# Altium project stlink.PrjPcb
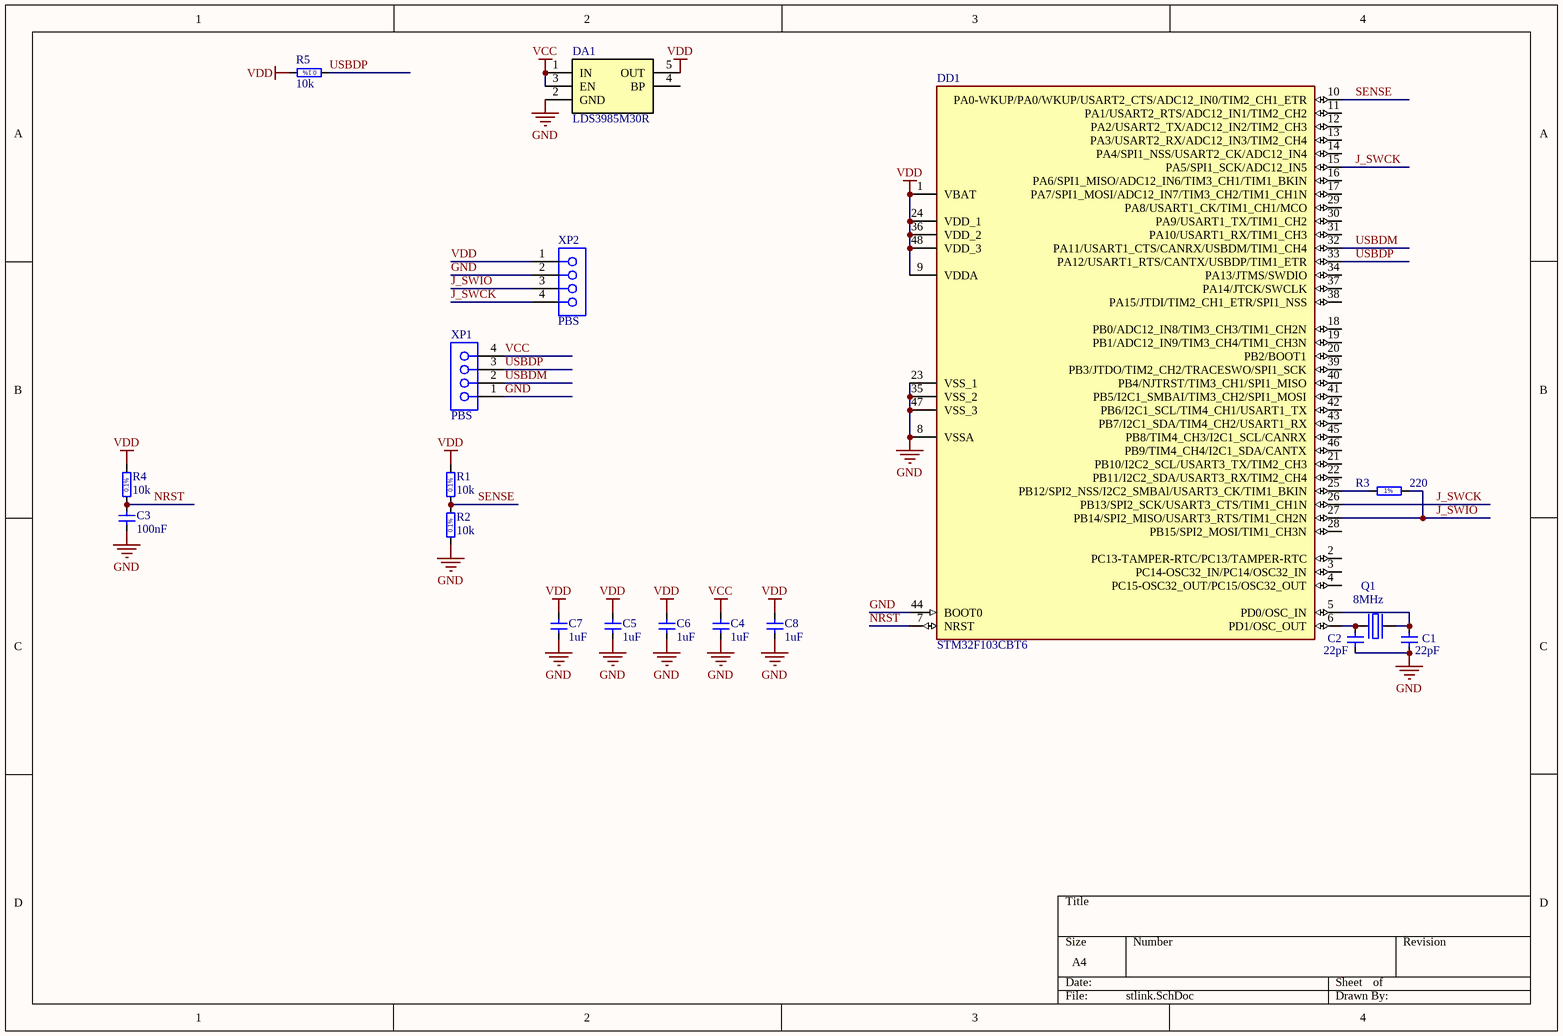
[diagram p0: stlink.SchDoc]
1 sheet, 18 parts. Net scope: global (net labels, ports and power ports of the same name join across sheets).
Board file: stlink.PcbDoc

## Sheet stlink.SchDoc
size A4

### Parts
C1  22pF  [CAP0603R]
C2  22pF  [CAP0603R]
C3  100nF  [CAP0603R]
C4  1uF  [CAP0603R]
C5  1uF  [CAP0603R]
C6  1uF  [CAP0603R]
C7  1uF  [CAP0603R]
C8  1uF  [CAP0603R]
DA1  LDS3985M30R  [SOT23-5]
DD1  STM32F103CBT6  [LQFP48]
Q1  8MHz  [XTAL_HC-49/U]
R1  10k  [RES0603R]
R2  10k  [RES0603R]
R3  220  [RES0603R]
R4  10k  [RES0603R]
R5  10k  [RES0603R]
XP1  PBS  [PBS-04]
XP2  PBS  [PBS-04]

### Nets
GND: C1.1 C2.1 C3.1 C4.1 C5.1 C6.1 C7.1 C8.1 DA1.2(GND) DD1.8(VSSA) DD1.23(VSS_1) DD1.35(VSS_2) DD1.44(BOOT0) DD1.47(VSS_3) R2.1 XP1.1 XP2.2
VCC: C4.2 DA1.1(IN) DA1.3(EN) XP1.4
VDD: C5.2 C6.2 C7.2 C8.2 DA1.5(OUT) DD1.1(VBAT) DD1.9(VDDA) DD1.24(VDD_1) DD1.36(VDD_2) DD1.48(VDD_3) R1.2 R4.2 R5.2 XP2.1
J_SWCK: DD1.15(PA5/SPI1_SCK/ADC12_IN5) DD1.26(PB13/SPI2_SCK/USART3_CTS/TIM1_CH1N) XP2.4
J_SWIO: DD1.27(PB14/SPI2_MISO/USART3_RTS/TIM1_CH2N) R3.2 XP2.3
NRST: C3.2 DD1.7(NRST) R4.1
SENSE: DD1.10(PA0-WKUP/PA0/WKUP/USART2_CTS/ADC12_IN0/TIM2_CH1_ETR) R1.1 R2.2
USBDM: DD1.32(PA11/USART1_CTS/CANRX/USBDM/TIM1_CH4) XP1.2
USBDP: DD1.33(PA12/USART1_RTS/CANTX/USBDP/TIM1_ETR) R5.1 XP1.3
NetC1_2: C1.2 DD1.5(PD0/OSC_IN) Q1.2(OSC2)
NetC2_2: C2.2 DD1.6(PD1/OSC_OUT) Q1.1(OSC1)
NetDD1_25: DD1.25(PB12/SPI2_NSS/I2C2_SMBAl/USART3_CK/TIM1_BKIN) R3.1

Not connected (* = marked no-connect by the designer): DA1 4(BP); DD1 2(PC13-TAMPER-RTC/PC13/TAMPER-RTC) 3(PC14-OSC32_IN/PC14/OSC32_IN) 4(PC15-OSC32_OUT/PC15/OSC32_OUT) 11(PA1/USART2_RTS/ADC12_IN1/TIM2_CH2) 12(PA2/USART2_TX/ADC12_IN2/TIM2_CH3) 13(PA3/USART2_RX/ADC12_IN3/TIM2_CH4) 14(PA4/SPI1_NSS/USART2_CK/ADC12_IN4) 16(PA6/SPI1_MISO/ADC12_IN6/TIM3_CH1/TIM1_BKIN) 17(PA7/SPI1_MOSI/ADC12_IN7/TIM3_CH2/TIM1_CH1N) 18(PB0/ADC12_IN8/TIM3_CH3/TIM1_CH2N) 19(PB1/ADC12_IN9/TIM3_CH4/TIM1_CH3N) 20(PB2/BOOT1) 21(PB10/I2C2_SCL/USART3_TX/TIM2_CH3) 22(PB11/I2C2_SDA/USART3_RX/TIM2_CH4) 28(PB15/SPI2_MOSI/TIM1_CH3N) 29(PA8/USART1_CK/TIM1_CH1/MCO) 30(PA9/USART1_TX/TIM1_CH2) 31(PA10/USART1_RX/TIM1_CH3) 34(PA13/JTMS/SWDIO) 37(PA14/JTCK/SWCLK) 38(PA15/JTDI/TIM2_CH1_ETR/SPI1_NSS) 39(PB3/JTDO/TIM2_CH2/TRACESWO/SPI1_SCK) 40(PB4/NJTRST/TIM3_CH1/SPI1_MISO) 41(PB5/I2C1_SMBAI/TIM3_CH2/SPI1_MOSI) 42(PB6/I2C1_SCL/TIM4_CH1/USART1_TX) 43(PB7/I2C1_SDA/TIM4_CH2/USART1_RX) 45(PB8/TIM4_CH3/I2C1_SCL/CANRX) 46(PB9/TIM4_CH4/I2C1_SDA/CANTX)

### Notes on the sheet
- (in symbol R0603_10K_0.1%_0.063W_10PPM) 0.1%
- (in symbol R0603_220R_1%_0.1W_100PPM) 1%

### Library data of the parts
C1 C2 = CC0603_22PF_50V_5%_NP0: SMD 0805 Capacitor; Part Description: SMD Multilayer Chip Ceramic Capacitor; Manufacturer: GENERIC; Manufacturer1 Part Number: 223886715229; Voltage: 50V; TC: NP0; Tolerance: ±5%; Table: Capacitors SMD; Part Number: CC0603_22PF_50V_5%_NP0; Component Kind: Standard; Component Type: Standard; Pin Count: 2; Value: 22pF; Status: Preferred; Manufacturer Part Number: CC0603_22PF_50V_5%_NP0; Case: 0603; Mounted: Yes; Socket: No; SMD: Yes; Manufacturer1 Example: PHYCOMP; Manufacturer1 ComponentHeight: 0.87mm; HelpURL: \\cern.ch\dfs\Applications\Altium\Datasheets\CC0603_NP0_PHYCOMP.pdf; Author: I. Kuznetsov; CreateDate: 03.12.2007; LatestRevisionDate: 03.12.2007
C3 = CC0603_100NF_100V_10%_X7R: SMD 0805 Capacitor; Part Description: SMD Multilayer Chip Ceramic Capacitor; Manufacturer: GENERIC; Manufacturer1 Part Number: GRM188R72A104KA35D; Voltage: 100V; TC: X7R; Tolerance: ±10%; Table: Capacitors SMD; Part Number: CC0603_100NF_100V_10%_X7R; Component Kind: Standard; Component Type: Standard; Pin Count: 2; Value: 100nF; Status: None; Manufacturer Part Number: CC0603_100NF_100V_10%_X7R; Case: 0603; Mounted: Yes; Socket: No; SMD: Yes; Manufacturer1 Example: MURATA; Manufacturer1 ComponentHeight: 0.9mm; HelpURL: \\cern.ch\dfs\Applications\Altium\Datasheets\CC0603_MURATA_GRM188R72A104KA35D.pdf; Author: I. Kuznetsov; CreateDate: 11.12.2013; LatestRevisionDate: 11.12.2013
C4-C8 = CC0603_1UF_25V_10%_X7R: SMD 0805 Capacitor; Part Description: SMD Multilayer Chip Ceramic Capacitor; Manufacturer: GENERIC; Manufacturer1 Part Number: GRM188R71E105KA12D; Voltage: 25V; TC: X7R; Tolerance: ±10%; Table: Capacitors SMD; Part Number: CC0603_1UF_25V_10%_X7R; Component Kind: Standard; Component Type: Standard; Pin Count: 2; Value: 1uF; Status: None; Manufacturer Part Number: CC0603_1UF_25V_10%_X7R; Case: 0603; Mounted: Yes; Socket: No; SMD: Yes; Manufacturer1 Example: MURATA; Manufacturer1 ComponentHeight: 0.9mm; HelpURL: \\cern.ch\dfs\Applications\Altium\Datasheets\CC0603_X7R_MURATA.pdf; Author: I. Kuznetsov; CreateDate: 18.01.2011; LatestRevisionDate: 18.01.2011
DA1 = LDS3985M30R: Manufacturer: ST; Поле1: Regulators; Part Number: LDS3985M30R; Component Kind: Standard; Component Type: Standard; Device: LDS3985M30R; Status: Active; Manufacturer Part Number: LDS3985M30R; Pin Count: 5; Case: SOT23-5; Mounted: Yes; Socket: No; SMD: Yes; Author: I. Kuznetsov
DD1 = STM32F103CBT6: Table: Microcontrollers; Part Number: STM32F103CBT6; Device: STM32F103CBT6
Q1 = XTAL_20MHZ_AEL_HC-49/U: Quartz Crystal; Part Description: ±30ppm Quartz Crystal Resonator, HC-49/U Type; Manufacturer: AEL CRYSTALS; Manufacturer Part Number: X20M000000L010; Table: Crystals & Oscillators; Part Number: XTAL_20MHZ_AEL_HC-49/U; Component Kind: Standard; Component Type: Standard; PackageDescription: HC-49/U Leaded Cristal, Body 11.05x4.8mm; Pitch 4.88mm; Value: 8MHz; Pin Count: 2; Mounted: Yes; Socket: No; SMD: No; ComponentHeight: 13.6mm; HelpURL: \\cern.ch\dfs\Applications\Altium\Datasheets\XTAL_AEL_HC-49-U.pdf; Author: CERN DEM JMW; CreateDate: 31.10.2008; LatestRevisionDate: 13.05.2011
R1 R2 R4 R5 = R0603_10K_0.1%_0.063W_10PPM: Part Description: Thin Film Chip Resistor; Manufacturer: GENERIC; Manufacturer1 Part Number: RN73C1J10KBTDF; Power: 0.063W; TC: ±10ppm; Tolerance: ±0.1%; Table: Resistors SMD; Part Number: R0603_10K_0.1%_0.063W_10PPM; Component Kind: Standard; Component Type: Standard; Footprint: RESC1608X55N; Pin Count: 2; Value: 10k; Status: Not recommended; Manufacturer Part Number: R0603_10K_0.1%_0.063W_10PPM; Case: 0603; Mounted: Yes; Socket: No; SMD: Yes; Manufacturer1 Example: TYCO HOLSWORTHY; Manufacturer1 ComponentHeight: 0.5mm; HelpURL: \\cern.ch\dfs\Applications\Altium\Datasheets\R0603_Tyco_RN73.pdf; Author: CERN DEM JLC; CreateDate: 03.12.2007; LatestRevisionDate: 13.03.2008
R3 = R0603_220R_1%_0.1W_100PPM: Part Description: General Purpose Thick Film Chip Resistor; Manufacturer: GENERIC; Manufacturer1 Part Number: NRC06F2200TRF; Power: 0.1W; TC: ±100ppm/°C; Tolerance: ±1%; Table: Resistors SMD; Part Number: R0603_220R_1%_0.1W_100PPM; Component Kind: Standard; Component Type: Standard; Footprint: RESC1608X55N; Pin Count: 2; Value: 220; Status: Preferred; Manufacturer Part Number: R0603_220R_1%_0.1W_100PPM; Case: 0603; Mounted: Yes; Socket: No; SMD: Yes; Manufacturer1 Example: NIC COMPONENT; Manufacturer1 ComponentHeight: 0.55mm; HelpURL: \\cern.ch\dfs\Applications\Altium\Datasheets\R0603_NIC_NRC.pdf; Author: CERN DEM JLC; CreateDate: 03.12.2007; LatestRevisionDate: 13.03.2008
XP1 XP2 = PBS-04: Table: AUK; Part Number: PBS-04; Family: PBS; Device: PBS-04